# Altium schematic sheet micro_mousev1.0.SchDoc
size A4; SheetNumber: 1; SheetTotal: 1
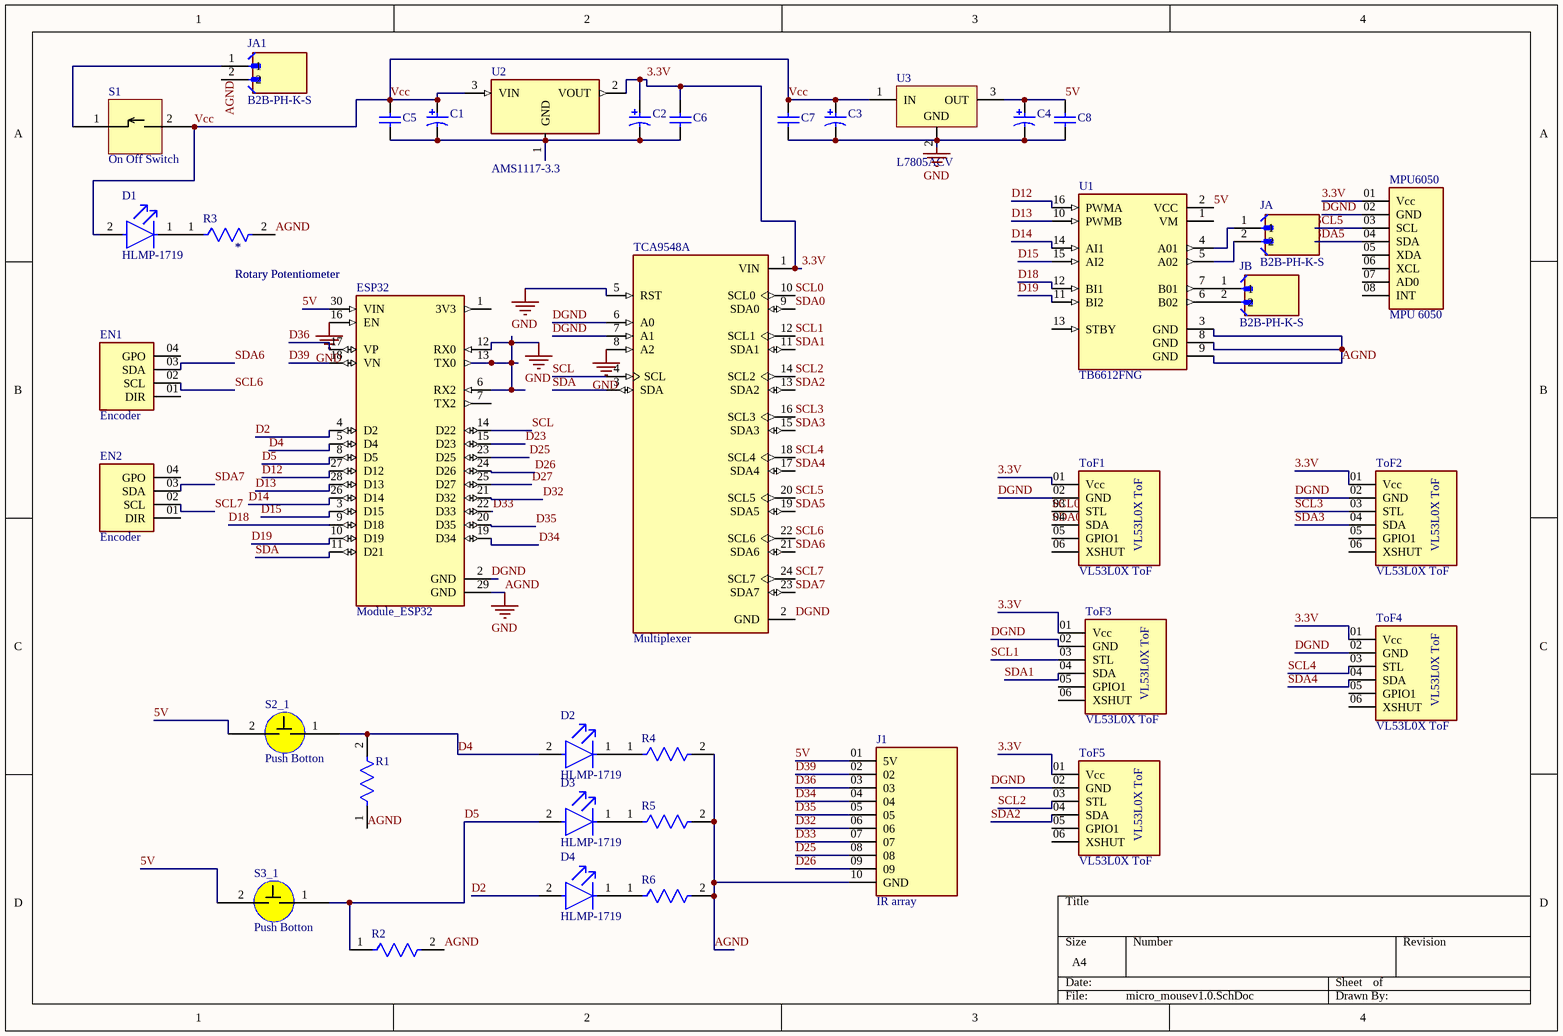
[diagram p0: micro_mousev1.0.SchDoc]

## Parts
(Parts that share a designator on the sheet are numbered #1, #2 ... from top to bottom, then left to right.)
*#1  Rotary Potentiometer
*#2  Rotary Potentiometer
C1  ECA1HM100  [CAPPR55-200-1100X500X1200]  (value not drawn)
C2  ECA1HM100  [CAPPR55-200-1100X500X1200]  (value not drawn)
C3  ECA1HM100  [CAPPR55-200-1100X500X1200]  (value not drawn)
C4  ECA1HM100  [CAPPR55-200-1100X500X1200]  (value not drawn)
C5  K104K15X7RF5TL2  [VISH-K104K15X7RF5TL2]  (value not drawn)
C6  K104K15X7RF5TL2  [VISH-K104K15X7RF5TL2]  (value not drawn)
C7  K104K15X7RF5TL2  [VISH-K104K15X7RF5TL2]  (value not drawn)
C8  K104K15X7RF5TL2  [VISH-K104K15X7RF5TL2]  (value not drawn)
D1  HLMP-1719  [FP-HLMP-1719-MFG]
D2  HLMP-1719  [FP-HLMP-1719-MFG]
D3  HLMP-1719  [FP-HLMP-1719-MFG]
D4  HLMP-1719  [FP-HLMP-1719-MFG]
EN1  Encoder  [Encoder 4 pin]
EN2  Encoder  [Encoder 4 pin]
ESP32  Module_ESP32  [MODULE_ESP32_DEVKIT_V1]
J1  IR array  [IR array]
JA  B2B-PH-K-S  [JST_B2B-PH-K-S]
JA1  B2B-PH-K-S  [JST_B2B-PH-K-S]
JB  B2B-PH-K-S  [JST_B2B-PH-K-S]
MPU6050  MPU 6050  [8 Pin MPU]
R1  PCF14JT7K50  [FP-CF14-MFG]  (value not drawn)
R2  PCF14JT7K50  [FP-CF14-MFG]  (value not drawn)
R3  PCF14JT7K50  [FP-CF14-MFG]  (value not drawn)
R4  PCF14JT7K50  [FP-CF14-MFG]  (value not drawn)
R5  PCF14JT7K50  [FP-CF14-MFG]  (value not drawn)
R6  PCF14JT7K50  [FP-CF14-MFG]  (value not drawn)
S1  On Off Switch  [Switch]
S2_1  Push Botton  [Push botton]
S3_1  Push Botton  [Push botton]
TCA9548A  Multiplexer  [MODULE_2717]
ToF1  VL53L0X ToF  [VL53L0X ToF]
ToF2  VL53L0X ToF  [VL53L0X ToF]
ToF3  VL53L0X ToF  [VL53L0X ToF]
ToF4  VL53L0X ToF  [VL53L0X ToF]
ToF5  VL53L0X ToF  [VL53L0X ToF]
U1  TB6612FNG  [TB6612FNG]
U2  AMS1117-3.3  [SOT229P700X180-4N]
U3  L7805ACV  [TO220]

## Nets
AGND: C3.2 C4.2 C7.1 C8.1 ESP32.6(RX2) ESP32.12(RX0) ESP32.13(TX0) ESP32.16(EN) ESP32.29(GND) J1.10(GND) JA1.2 R1.1 R2.2 R3.2 R4.2 R5.2 R6.2 TCA9548A.5(RST) TCA9548A.8(A2) U1.3(GND) U1.8(GND) U1.9(GND)  [also labelled GND]
3.3V: C2.1 C6.2 MPU6050.01(Vcc) TCA9548A.1(VIN) ToF1.01(Vcc) ToF2.01(Vcc) ToF3.01(Vcc) ToF4.01(Vcc) ToF5.01(Vcc) U2.2(VOUT)
5V: C4.1 C8.2 ESP32.30(VIN) J1.01(5V) S2_1.2(P29) S3_1.2(P29) U1.2(VCC) U3.3(OUT)
D2: D4.2(A) ESP32.4(D2)
D4: D2.2(A) ESP32.5(D4) R1.2 S2_1.1(P30)
D5: D3.2(A) ESP32.8(D5) R2.1 S3_1.1(P30)
D12: ESP32.27(D12) U1.16(PWMA)
D13: ESP32.28(D13) U1.10(PWMB)
D14: ESP32.26(D14) U1.14(AI1)
D15: ESP32.3(D15) U1.15(AI2)
D18: ESP32.9(D18) U1.12(BI1)
D19: ESP32.10(D19) U1.11(BI2)
D23: ESP32.15(D23)
D25: ESP32.23(D25) J1.08
D26: ESP32.24(D26) J1.09
D27: ESP32.25(D27)
D32: ESP32.21(D32) J1.06
D33: ESP32.22(D33) J1.07
D34: ESP32.19(D34) J1.04
D35: ESP32.20(D35) J1.05
D36: ESP32.17(VP) J1.03
D39: ESP32.18(VN) J1.02
DGND: ESP32.2(GND) MPU6050.02(GND) TCA9548A.2(GND) TCA9548A.6(A0) TCA9548A.7(A1) ToF1.02(GND) ToF2.02(GND) ToF3.02(GND) ToF4.02(GND) ToF5.02(GND)
SCL: ESP32.14(D22) TCA9548A.4(SCL)
SCL0: TCA9548A.10(SCL0) ToF1.03(STL)
SCL1: TCA9548A.12(SCL1) ToF3.03(STL)
SCL2: TCA9548A.14(SCL2) ToF5.03(STL)
SCL3: TCA9548A.16(SCL3) ToF2.03(STL)
SCL4: TCA9548A.18(SCL4) ToF4.03(STL)
SCL5: MPU6050.03(SCL) TCA9548A.20(SCL5)
SCL6: EN1.02(SCL) TCA9548A.22(SCL6)
SCL7: EN2.02(SCL) TCA9548A.24(SCL7)
SDA: ESP32.11(D21) TCA9548A.3(SDA)
SDA0: TCA9548A.9(SDA0) ToF1.04(SDA)
SDA1: TCA9548A.11(SDA1) ToF3.04(SDA)
SDA2: TCA9548A.13(SDA2) ToF5.04(SDA)
SDA3: TCA9548A.15(SDA3) ToF2.04(SDA)
SDA4: TCA9548A.17(SDA4) ToF4.04(SDA)
SDA5: MPU6050.04(SDA) TCA9548A.19(SDA5)
SDA6: EN1.03(SDA) TCA9548A.21(SDA6)
SDA7: EN2.03(SDA) TCA9548A.23(SDA7)
Vcc: C1.1 C3.1 C5.2 C7.2 D1.2(A) S1.2 U2.3(VIN) U3.1(IN)
NetC1_2: C1.2 C2.2 C5.1 C6.1 U2.1(GND)
NetD1_1: D1.1(C) R3.1
NetD2_1: D2.1(C) R4.1
NetD3_1: D3.1(C) R5.1
NetD4_1: D4.1(C) R6.1
NetJA1_1: JA1.1 S1.1(P27)
NetJA_1: JA.1 U1.4(A01)
NetJA_2: JA.2 U1.5(A02)
NetJB_1: JB.1 U1.7(B01)
NetJB_2: JB.2 U1.6(B02)

Not connected (* = marked no-connect by the designer): EN1 01(DIR) 04(GPO); EN2 01(DIR) 04(GPO); ESP32 1(3V3) 7(TX2); MPU6050 05(XDA) 06(XCL) 07(AD0) 08(INT); ToF1 05(GPIO1) 06(XSHUT); ToF2 05(GPIO1) 06(XSHUT); ToF3 05(GPIO1) 06(XSHUT); ToF4 05(GPIO1) 06(XSHUT); ToF5 05(GPIO1) 06(XSHUT); U1 1(VM) 13(STBY); U3 2(GND)

## Library data of the parts
C1-C4 = CMP-1665-00038-2: Aluminum Electrolytic Capacitor, 10 uF, +/- 20%, 50 V, -40 to 85 degC, 2-Pin THD, RoHS, Bulk; Manufacturer: Panasonic; Life (Hours): 2000Hour; Lead/Base Style: Straight; Dissipation Factor: 0.12%; Capacitance: 10uF; Leakage Current: 3uA; Dielectric Material: Aluminium; Lead Diameter: 0.5mm; Voltage Rating: 50V; Ripple Current: 65mA; Package Reference: CAPPR55-200-1100X500X1200; Height: 11mm; Diameter: 5mm; REACH SVHC: NoSVHC; Mount: ThroughHole; Packaging: Bulk; Manufacturer URL: http://www.panasonic.com/; Termination: Radial; Datasheet URL: https://industrial.panasonic.com/cdbs/www-data/pdf/RDF0000/ABA0000C1218.pdf; Lead Free: LeadFree; Height - Seated (Max): 0.472inch; Case/Package: Radial; Package Description: 2-Pin Radial Lead, Dia 5 mm, Height 12 mm; Tolerance: 20%; Datasheet Version: Rev. 05, 10/2016; Package Quantity: 200; Ripple Current (AC): 65mA; Min Operating Temperature: -40degC; RoHSCompliant: true; Number of Pins: 2; Max Operating Temperature: 85degC; Voltage: 50V; Lead Pitch: 2mm; Radiation Hardening: No; Voltage Rating (DC): 50V; Length: 11mm
C5-C8 = CMP-2000-06508-1: Ceramic Capacitor, 100 nF, +/- 10%, 50 V, -55 to 125 degC, 2-Pin THD, RoHS, Tape and Reel; Manufacturer: Vishay; Other Names: BC1084CT; Catalog Drawings: Mono-KapSide2-15_5.58Mono-KapSide1_15; Temperature Coefficient: X7R; Voltage - Rated: 50V; Online Catalog: Mono-Kap™Series; Capacitance: 0.1µF; Size / Dimension: 0.157"Lx0.098"W(4.00mmx2.50mm); Operating Temperature: -55°C~125°C; Family: CeramicCapacitors; Manufacturer URL: http://www.vishay.com/; Standard Package: 1; Thickness (Max): -; Ratings: -; Datasheet Version: 08/2013; Package Description: 2-Pin Through Hole Device, Body 4 x 2.6 mm; Mounting Type: ThroughHole; Features: -; Lead Spacing: 0.098"(2.50mm); Tolerance: ±10%; Category: Capacitors; Mounting Technology: ThroughHole; Lead Style: Straight; Datasheet URL: http://www.vishay.com/docs/45171/kseries.pdf; Applications: GeneralPurpose; Package / Case: Radial; Height - Seated (Max): 0.220"(5.58mm); Package Reference: K104K15X7RF5TL2; Series: Mono-Kap™K; Packaging: CutTape(CT)
D1-D4 = CMP-2000-06410-2: LED YELLOW DIFFUSED T-1 T/H; Manufacturer: Broadcom; Wavelength: 585nm; Led Orientation: Straight; Luminous Intensity: 2.1mcd; Forward Voltage: 1.8V; Viewing Angle: 50°; Reverse Voltage: 5V; Power Dissipation: 17.5mW; Forward Current: 2mA; Lead Free: Yes; Automotive: No; Device Class L1: Optoelectronics; Mouser Description: Standard LEDs - Through Hole Yellow Diffused 585nm 2.1mcd; Digikey Description: LED YELLOW DIFFUSED T-1 T/H; Temperature: -40°C to +100°C; Temperature Range High: +100°C; Package: 0; Category: Diode; Colour: Yellow; Device Class L2: LEDs; ComponentLink2Description: Datasheet; ComponentLink2URL: https://docs.broadcom.com/docs/AV02-1557EN; Temperature Range Low: -40°C; Device Class L3: unset; Octopart: https://octopart.com/hlmp-1719-broadcom-71130405; RoHS: TRUE; Manufacturer Part Number: HLMP-1719
EN1 EN2 = Encoder: Variable Post Height Header Strips, 2.00 mm Pitch; MF: SAMTEC; MP: MTMM-104-08-T-S-315; SnapEDA_Link: https://www.snapeda.com/parts/MTMM-104-08-T-S-315/Samtec/view-part/?ref=snap; Package: None; Value: *; Check_prices: https://www.snapeda.com/parts/MTMM-104-08-T-S-315/Samtec/view-part/?ref=eda
J1 = IR array: MP: TSW-210-15-L-S; Package: None; Price: None; Value: *; Availability: Unavailable
JA JA1 JB = B2B-PH-K-S: Connector Header Through Hole 2 position 0.079 (2.00mm); MF: JST Sales America Inc.; SnapEDA_Link: https://www.snapeda.com/parts/B2B-PH-K-S/JST/view-part/?ref=snap; Package: None; Value: *; MP: B2B-PH-K-S; Check_prices: https://www.snapeda.com/parts/B2B-PH-K-S/JST/view-part/?ref=eda
MPU6050 = MPU 6050: CONN HDR .050 8POS; MF: Samtec; MP: MTMS-108-02-T-S-100; SnapEDA_Link: https://www.snapeda.com/parts/MTMS-108-02-T-S-100/Samtec/view-part/?ref=snap; Package: None; Value: *; Check_prices: https://www.snapeda.com/parts/MTMS-108-02-T-S-100/Samtec/view-part/?ref=eda
R1-R6 = CMP-26528-000003-1: RES 7.5K OHM 1/4W 5% AXIAL; Max Power Dissipation: 250mW; Temperature Coefficient: -400ppm/°C; Resistance: 7.5kR; RoHS Compliant: Yes; Lead Free: Lead Free; Max Operating Temperature: 155°C; Case/Package: Axial; Tolerance: 5%; Power Rating: 250mW; Diameter: 2.3mm; Features: Flame Retardant Coating; Series: CF; Resistor Type: Carbon Film; Number of Terminations: 2; Length: 0.256inch; Min Operating Temperature: -55°C; Contact Plating: Tin; Packaging: Tape and Reel; Mount: Through Hole; Radiation Hardening: No
TCA9548A = Multiplexer: Module: multiplexer; I2C interface multiplexer; TCA9548A; 3Ã·5VDC; MF: Adafruit; MP: 2717; SnapEDA_Link: https://www.snapeda.com/parts/2717/Adafruit+Industries/view-part/?ref=snap; Package: None; Value: *; Check_prices: https://www.snapeda.com/parts/2717/Adafruit+Industries/view-part/?ref=eda
ToF1-ToF5 = VL53L0X ToF: MP: ZW-06-09-L-S-312-160; Value: *; Availability: Unavailable; Package: None; Price: None
U1 = TB6612FNG: TB6612FNG Motor Controller/Driver Power Management Evaluation Board; MP: ROB-14450; MF: SparkFun Electronics; Check_prices: https://www.snapeda.com/parts/ROB-14450/SparkFun%20Electronics/view-part/2656367/?ref=eda; Package: None; Value: *; Availability: In Stock; SnapEDA_Link: https://www.snapeda.com/parts/ROB-14450/SparkFun%20Electronics/view-part/2656367/?ref=snap; Price: None
U2 = AMS1117-3.3: Sot223/Pkg 1-Amp 3.3-Volt Low Drop Out Voltage Regulatator; MF: Advanced Monolithic Systems; SnapEDA_Link: https://www.snapeda.com/parts/AMS1117-3.3/Advanced+Monolithic+Systems/view-part/?ref=snap; Package: SOT-223 Seeed Technology; Value: *; MP: AMS1117-3.3; Check_prices: https://www.snapeda.com/parts/AMS1117-3.3/Advanced+Monolithic+Systems/view-part/?ref=eda
U3 = CMP-0244-00484-1: Positive Voltage Regulator, 5V, 3-Pin TO-220; DatasheetVersion: 16/11/2011; ComponentLink2Description: Datasheet; ComponentLink3Description: Package Specification; ComponentLink2URL: http://www.st.com/internet/com/TECHNICAL_RESOURCES/TECHNICAL_LITERATURE/DATASHEET/CD00000444.pdf; PackageDescription: TO, Thru-Hole, Vertical, Heatsink Mounted; 3 In-Line Leads; Pitch 2.54 mm; ComponentLink3URL: http://www.st.com/internet/com/TECHNICAL_RESOURCES/TECHNICAL_LITERATURE/PACKAGE_INFORMATION/CD00004649.pdf; PackageReference: TO220; ComponentLink1URL: http://www.st.com; PackageVersion: ver3.0; ComponentLink1Description: Manufacturer URL